# Altium schematic sheet Vicor Converter 1.SchDoc: Vicor Maxi Converter 1
size A; DrawnBy: Adam Vadala-Roth; Revision: 1.1b; SheetNumber: 1; SheetTotal: 2
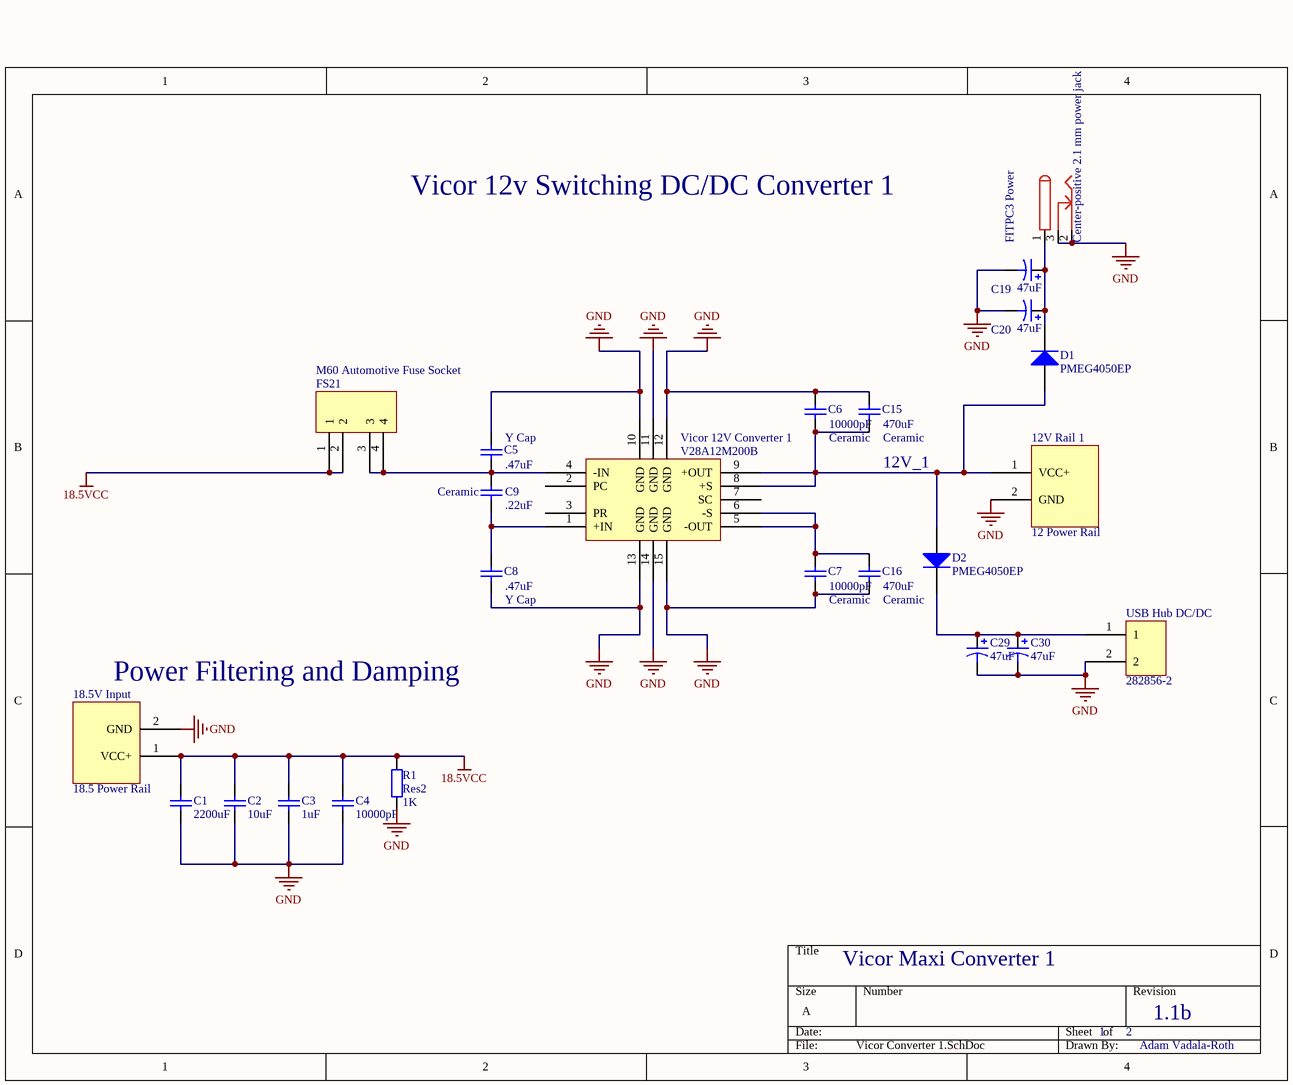
[diagram p0: Vicor Converter 1.SchDoc]

## Parts
12V_Rail_1  12 Power Rail  [Power Rail 12]
18.5V_Input  18.5 Power Rail  [Power Rail Pad]
C1  value 2200uF  [CAPPR5-12.5x40]
C2  value 10uF  [CAPPR2-5x11]
C3  value 1uF  [CAPPR2-5x11]
C4  value 10000pF  [CAPRD5-6.5x4.5]
C5  value .47uF  [CAPRD7.5-12x4.5]  (hidden comment: Cap)
C6  value 10000pF  [CAPRD7.5-12x4.5]  (hidden comment: Cap)
C7  value 10000pF  [CAPRD7.5-12x4.5]  (hidden comment: Cap)
C8  value .47uF  [CAPRD7.5-12x4.5]
C9  value .22uF  [Vicor AC CAP 0.22uF 250VAC]  (hidden comment: Cap)
C15  value 470uF  [CAPRD7.5-12x4.5]  (hidden comment: Cap)
C16  value 470uF  [CAPRD7.5-12x4.5]  (hidden comment: Cap)
C19  value 47uF  [CAPPR2.5-6.3x5]  (hidden comment: Cap Pol1)
C20  value 47uF  [CAPPR2.5-6.3x5]  (hidden comment: Cap Pol1)
C29  value 47uF  [CAPPR2.5-6.3x5]  (hidden comment: Cap Pol1)
C30  value 47uF  [CAPPR2.5-6.3x5]  (hidden comment: Cap Pol1)
D1  PMEG4050EP  [NXP Schottkey reverse]
D2  PMEG4050EP  [NXP Schottkey reverse]
FITPC3_Power  Center-positive 2.1 mm power jack  [PJ-102AH]
FS21  M60 Automotive Fuse Socket  [M60]
R1  Res2  value 1K  [AXIAL-0.4]
USB_Hub_DC/DC  282856-2  [282856-2]
Vicor_12V_Converter_1  V28A12M200B  [Vicor Maxi DC DC Converter]

## Nets
18.5VCC: 18.5V_Input.1(VCC+) C1.1 C2.1 C3.1 C4.1 FS21.1 FS21.2 R1.2
GND: 12V_Rail_1.2(GND) 18.5V_Input.2(GND) C1.2 C2.2 C3.2 C4.2 C5.2 C6.2 C7.1 C8.1 C15.2 C16.1 C19.2 C20.2 C29.2 C30.2 FITPC3_Power.2 FITPC3_Power.3 R1.1 USB_Hub_DC/DC.2 Vicor_12V_Converter_1.10(GND) Vicor_12V_Converter_1.11(GND) Vicor_12V_Converter_1.12(GND) Vicor_12V_Converter_1.13(GND) Vicor_12V_Converter_1.14(GND) Vicor_12V_Converter_1.15(GND)
Net12V_Rail_1_1: 12V_Rail_1.1(VCC+) C6.1 C15.1 D1.1(A) D2.1(A) Vicor_12V_Converter_1.8(+S) Vicor_12V_Converter_1.9(+OUT)
NetC5_1: C5.1 C9.2 FS21.3 FS21.4 Vicor_12V_Converter_1.4(-IN)
NetC7_2: C7.2 C16.2 Vicor_12V_Converter_1.5(-OUT) Vicor_12V_Converter_1.6(-S)
NetC8_2: C8.2 C9.1 Vicor_12V_Converter_1.1(+IN)
NetC19_1: C19.1 C20.1 D1.2(K) FITPC3_Power.1
NetC29_1: C29.1 C30.1 D2.2(K) USB_Hub_DC/DC.1

Not connected (* = marked no-connect by the designer): Vicor_12V_Converter_1 2(PC) 3(PR) 7(SC)

## Notes on the sheet
- Vicor 12v Switching DC/DC Converter 1
- (near C9) Ceramic
- (near C5) Y Cap
- Ceramic
- (near C15) 12V_1
- (near C15) Ceramic
- (near C8) Y Cap
- (near 18.5V_Input) Power Filtering and Damping

## Library data of the parts
C1-C9 C15 C16 = Cap: Capacitor; Published: 8-Jun-2000; LatestRevisionDate: 17-Jul-2002; LatestRevisionNote: Re-released for DXP Platform.; PackageReference: RAD-0.3; Publisher: Altium Limited; PackageDescription: Radial Cap, Thru-Hole; 2 Leads; 0.3 in Pin Spacing
C19 C20 C29 C30 = Cap Pol1: Polarized Capacitor (Radial); Published: 8-Jun-2000; LatestRevisionDate: 17-Jul-2002; LatestRevisionNote: Re-released for DXP Platform.; PackageReference: RB7.6-15; Publisher: Altium Limited; PackageDescription: Polarized Capacitor (Radial); 2 Leads
D1 D2 = Diode: Default Diode; Published: 8-Jun-2000; LatestRevisionDate: 17-Jul-2002; LatestRevisionNote: Re-released for DXP Platform.; PackageVersion: Sep-1996; PackageReference: SMC; Publisher: Altium Limited; PackageDescription: DO-214-AB/SMC; 2 C-Bend Leads; Body 7.9 x 5.9 mm, inc. leads (LxW); Code_JEDEC: DO-214-AB
FITPC3_Power = PWR2.5: Power jack; Published: 17-Dec-2003; DatasheetDocument: 09-May-2002; Publisher: Altium Limited; ComponentLink1Description: Manufacturer Link; ComponentLink1URL: http://domino.kycon.com/internet/Products.html
FS21 = M60 Automotive Fuse: Automotive Fuse Socket
R1 = Res2: Resistor; Published: 8-Jun-2000; LatestRevisionDate: 17-Jul-2002; LatestRevisionNote: Re-released for DXP Platform.; PackageReference: AXIAL-0.4; Publisher: Altium Limited; PackageDescription: Axial Device, Thru-Hole; 2 Leads; 0.4 in Pin Spacing
USB_Hub_DC/DC = 282856-2: Two pole screw terminal
Vicor_12V_Converter_1 = V28A12M200B: V28A12M200B 12V DC/DC Converter